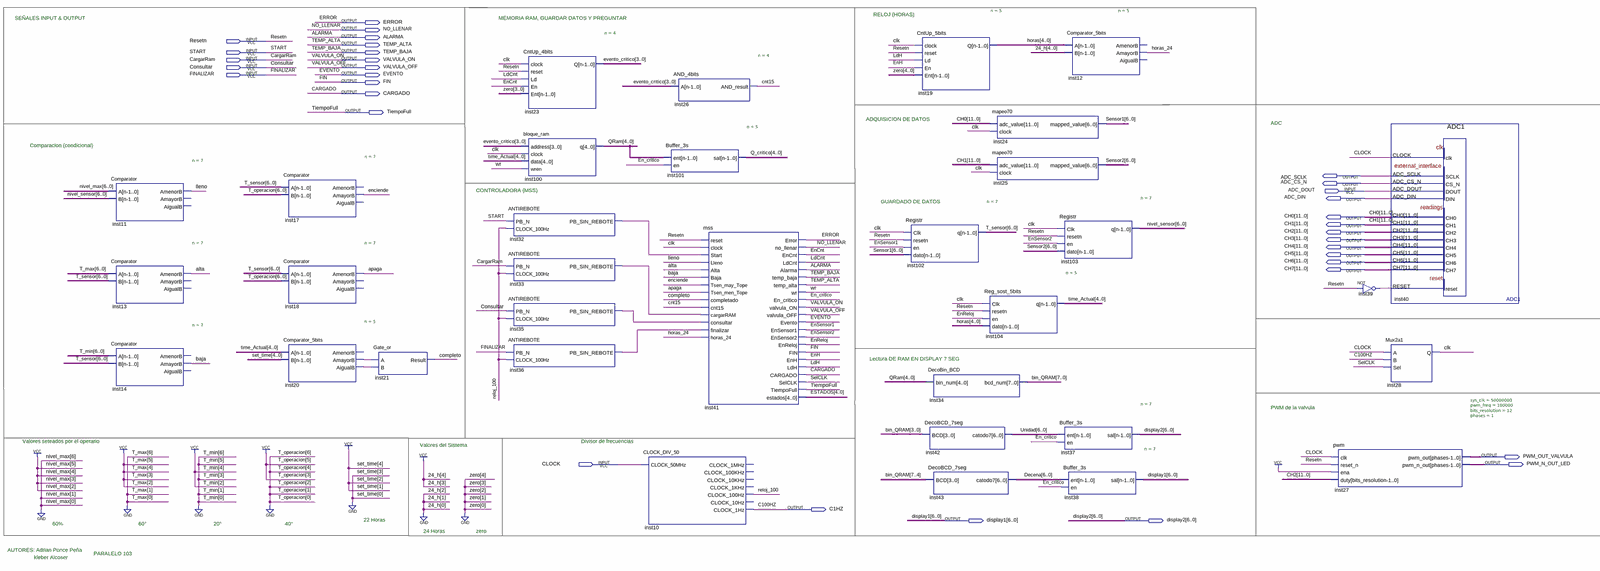
[diagram p0: schematic sheet, whole]
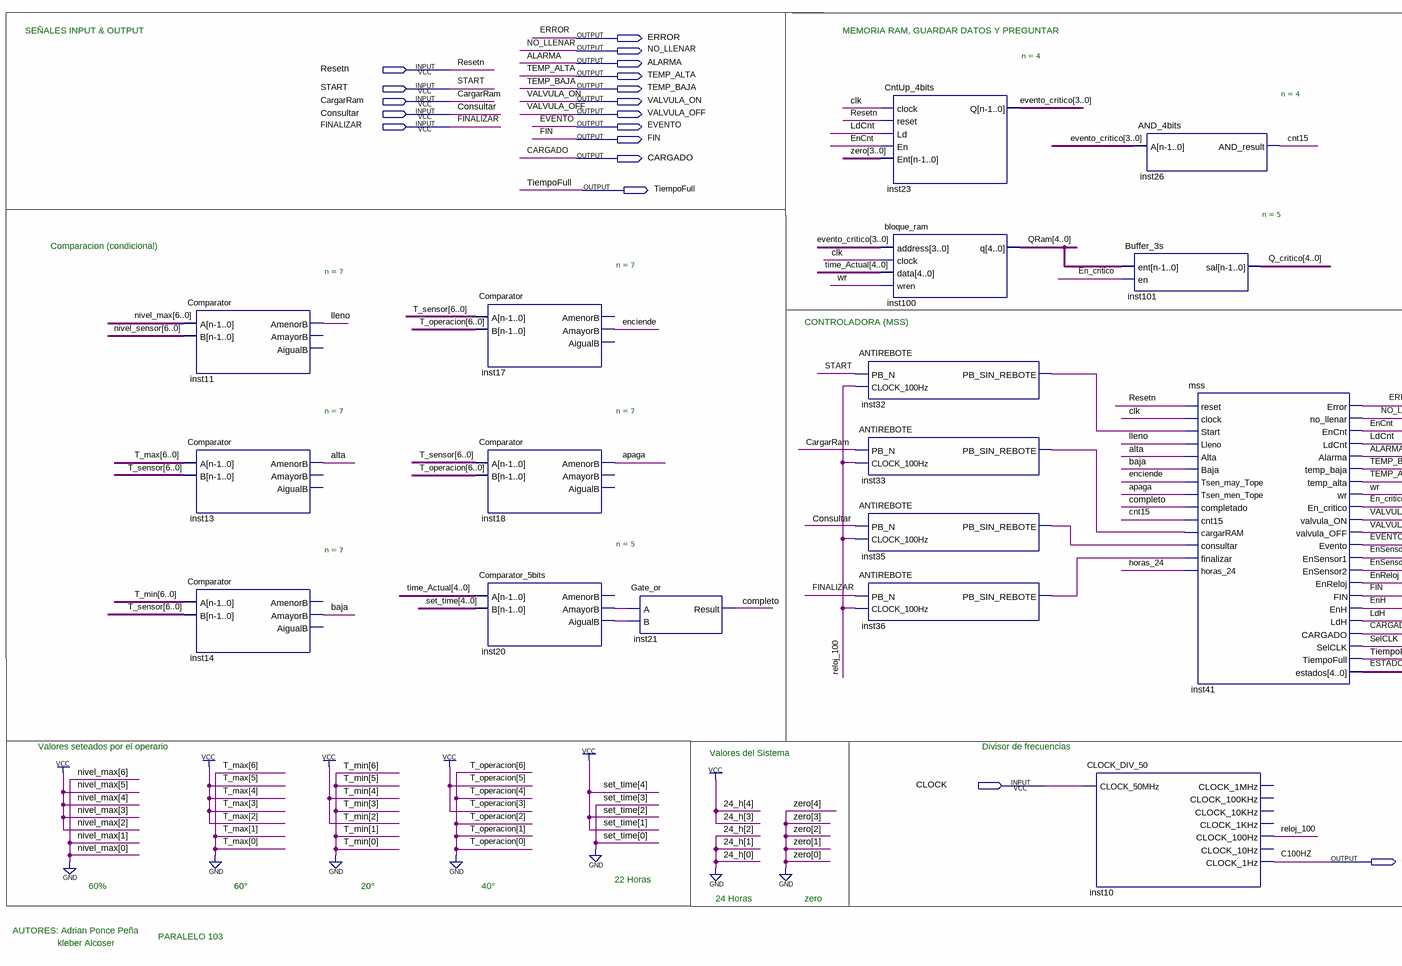
[diagram p1: schematic sheet, left part]
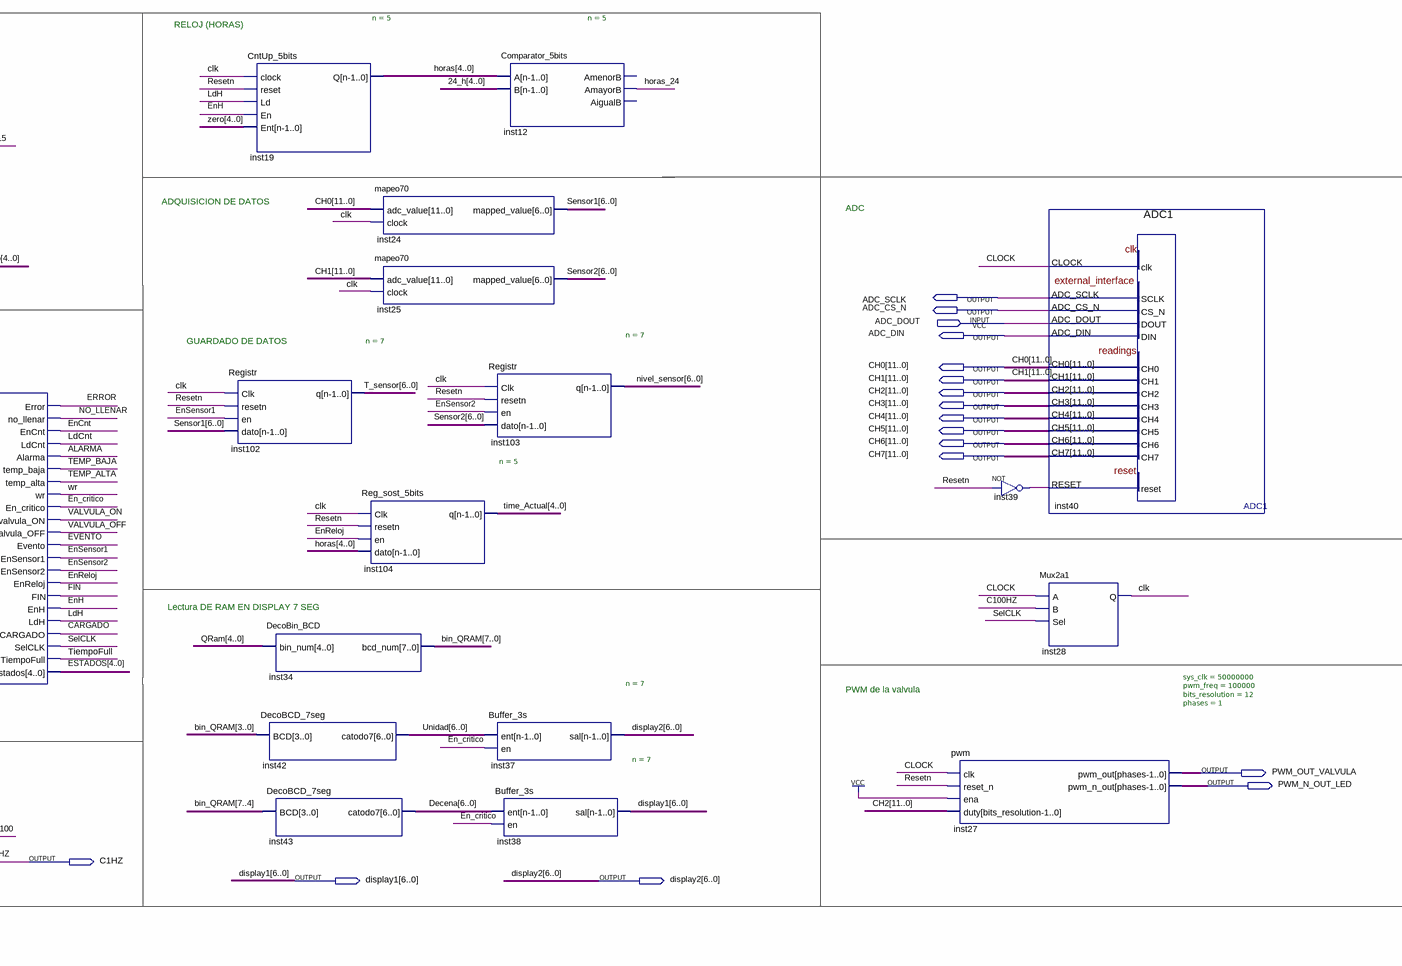
[diagram p2: schematic sheet, right part]
// Quartus schematic PROYECTO.bdf as structural Verilog: 33 symbols, 34 pins
module PROYECTO (
  input  Resetn,
  input  START,
  input  CargarRam,
  input  Consultar,
  input  FINALIZAR,
  input  ADC_DOUT,
  input  CLOCK,
  output ERROR,
  output NO_LLENAR,
  output ALARMA,
  output TEMP_ALTA,
  output TEMP_BAJA,
  output VALVULA_ON,
  output VALVULA_OFF,
  output EVENTO,
  output FIN,
  output CARGADO,
  output TiempoFull,
  output ADC_SCLK,
  output ADC_CS_N,
  output ADC_DIN,
  output [11:0] CH0,
  output [11:0] CH1,
  output [11:0] CH2,
  output [11:0] CH3,
  output [11:0] CH4,
  output [11:0] CH5,
  output [11:0] CH6,
  output [11:0] CH7,
  output PWM_OUT_VALVULA,
  output PWM_N_OUT_LED,
  output C1HZ,
  output [6:0] display1,
  output [6:0] display2
);

  wire alta, apaga, baja, clk, cnt15, completo, En_critico, enciende, EnCnt, EnH, EnReloj, EnSensor1,
       EnSensor2, horas_24, inst20_aigualb, inst20_amayorb, inst32_pb_sin_rebote, inst33_pb_sin_rebote,
       inst35_pb_sin_rebote, inst36_pb_sin_rebote, inst39_out, LdCnt, LdH, lleno, reloj_100, SelCLK, wr;
  wire [3:0] evento_critico;
  wire [4:0] ESTADOS, horas, Q_critico, QRam, time_Actual;
  wire [6:0] Decena, nivel_sensor, Sensor1, Sensor2, T_sensor, Unidad;
  wire [7:0] bin_QRAM;

  Comparator #(.n(7)) inst11 (.A(7'b0111100), .B(nivel_sensor), .AmenorB(lleno));  // open: AmayorB, AigualB
  Comparator #(.n(7)) inst13 (.A(7'b0111100), .B(T_sensor), .AmenorB(alta));  // open: AmayorB, AigualB
  Comparator #(.n(7)) inst14 (.A(7'b0010100), .B(T_sensor), .AmayorB(baja));  // open: AmenorB, AigualB
  Comparator #(.n(7)) inst17 (.A(T_sensor), .B(7'b0101000), .AmayorB(enciende));  // open: AmenorB, AigualB
  Comparator #(.n(7)) inst18 (.A(T_sensor), .B(7'b0101000), .AmenorB(apaga));  // open: AmayorB, AigualB
  Comparator_5bits #(.n(5)) inst20 (
    .A(time_Actual), .B(5'b10110), .AmayorB(inst20_amayorb), .AigualB(inst20_aigualb));  // open: AmenorB
  Gate_or inst21 (.A(inst20_amayorb), .B(inst20_aigualb), .Result(completo));
  ANTIREBOTE inst32 (.PB_N(START), .CLOCK_100Hz(reloj_100), .PB_SIN_REBOTE(inst32_pb_sin_rebote));
  ANTIREBOTE inst33 (.PB_N(CargarRam), .CLOCK_100Hz(reloj_100), .PB_SIN_REBOTE(inst33_pb_sin_rebote));
  ANTIREBOTE inst35 (.PB_N(Consultar), .CLOCK_100Hz(reloj_100), .PB_SIN_REBOTE(inst35_pb_sin_rebote));
  ANTIREBOTE inst36 (.PB_N(FINALIZAR), .CLOCK_100Hz(reloj_100), .PB_SIN_REBOTE(inst36_pb_sin_rebote));
  CntUp_4bits #(.n(4)) inst23 (.clock(clk), .reset(Resetn), .Ld(LdCnt), .En(EnCnt), .Ent(4'b0000), .Q(evento_critico));
  bloque_ram inst100 (.address(evento_critico), .clock(clk), .data(time_Actual), .wren(wr), .q(QRam));
  CLOCK_DIV_50 inst10 (
    .CLOCK_50MHz(CLOCK), .CLOCK_100Hz(reloj_100), .CLOCK_1Hz(C1HZ));  // open: CLOCK_1MHz, CLOCK_100KHz, CLOCK_10KHz, CLOCK_1KHz, CLOCK_10Hz
  AND_4bits #(.n(4)) inst26 (.A(evento_critico), .AND_result(cnt15));
  Buffer_3s #(.n(5)) inst101 (.ent(QRam), .en(En_critico), .sal(Q_critico));
  mss inst41 (
    .reset(Resetn), .clock(clk), .Start(inst32_pb_sin_rebote), .Lleno(lleno), .Alta(alta), .Baja(baja),
    .Tsen_may_Tope(enciende), .Tsen_men_Tope(apaga), .completado(completo), .cnt15(cnt15),
    .cargarRAM(inst33_pb_sin_rebote), .consultar(inst35_pb_sin_rebote), .finalizar(inst36_pb_sin_rebote),
    .horas_24(horas_24), .Error(ERROR), .no_llenar(NO_LLENAR), .EnCnt(EnCnt), .LdCnt(LdCnt), .Alarma(ALARMA),
    .temp_baja(TEMP_BAJA), .temp_alta(TEMP_ALTA), .wr(wr), .En_critico(En_critico), .valvula_ON(VALVULA_ON),
    .valvula_OFF(VALVULA_OFF), .Evento(EVENTO), .EnSensor1(EnSensor1), .EnSensor2(EnSensor2),
    .EnReloj(EnReloj), .FIN(FIN), .EnH(EnH), .LdH(LdH), .CARGADO(CARGADO), .SelCLK(SelCLK),
    .TiempoFull(TiempoFull), .estados(ESTADOS));
  CntUp_5bits #(.n(5)) inst19 (.clock(clk), .reset(Resetn), .Ld(LdH), .En(EnH), .Ent({5{1'b0}}), .Q(horas));
  Registr #(.n(7)) inst102 (.Clk(clk), .resetn(Resetn), .en(EnSensor1), .dato(Sensor1), .q(T_sensor));
  DecoBin_BCD inst34 (.bin_num(QRam), .bcd_num(bin_QRAM));
  DecoBCD_7seg inst42 (.BCD(bin_QRAM[3:0]), .catodo7(Unidad));
  DecoBCD_7seg inst43 (.BCD(bin_QRAM[7:4]), .catodo7(Decena));
  Reg_sost_5bits #(.n(5)) inst104 (.Clk(clk), .resetn(Resetn), .en(EnReloj), .dato(horas), .q(time_Actual));
  mapeo70 inst24 (.adc_value(CH0), .clock(clk), .mapped_value(Sensor1));
  mapeo70 inst25 (.adc_value(CH1), .clock(clk), .mapped_value(Sensor2));
  Comparator_5bits #(.n(5)) inst12 (.A(horas), .B(5'b11000), .AmayorB(horas_24));  // open: AmenorB, AigualB
  Registr #(.n(7)) inst103 (.Clk(clk), .resetn(Resetn), .en(EnSensor2), .dato(Sensor2), .q(nivel_sensor));
  Buffer_3s #(.n(7)) inst37 (.ent(Unidad), .en(En_critico), .sal(display2));
  Buffer_3s #(.n(7)) inst38 (.ent(Decena), .en(En_critico), .sal(display1));
  pwm #(.sys_clk(50000000), .pwm_freq(100000), .bits_resolution(12), .phases(1)) inst27 (
    .clk(CLOCK), .reset_n(Resetn), .ena(1'b1), .duty(CH2), .pwm_out(PWM_OUT_VALVULA),
    .pwm_n_out(PWM_N_OUT_LED));
  not inst39 (inst39_out, Resetn);
  ADC1 inst40 (
    .CLOCK(CLOCK), .ADC_DOUT(ADC_DOUT), .RESET(inst39_out), .ADC_SCLK(ADC_SCLK), .ADC_CS_N(ADC_CS_N),
    .ADC_DIN(ADC_DIN), .CH0(CH0), .CH1(CH1), .CH2(CH2), .CH3(CH3), .CH4(CH4), .CH5(CH5), .CH6(CH6), .CH7(CH7));
  Mux2a1 inst28 (.A(CLOCK), .B(C1HZ), .Sel(SelCLK), .Q(clk));

  // Other names for the same wires on the sheet: C100HZ = C1HZ

  // Notes on the sheet:
  //   RELOJ (HORAS)
  //   SEÑALES INPUT & OUTPUT
  //   MEMORIA RAM, GUARDAR DATOS Y PREGUNTAR
  //   ADQUISICION DE DATOS
  //   ADC
  //   Comparacion (condicional)
  //   CONTROLADORA (MSS)
  //   GUARDADO DE DATOS
  //   Lectura DE RAM EN DISPLAY 7 SEG
  //   PWM de la valvula
  //   Valores seteados por el operario
  //   Divisor de frecuencias
  //   Valores del Sistema
  //   22 Horas
  //   60%
  //   60°
  //   20°
  //   40°
  //   24 Horas
  //   zero
  //   AUTORES: Adrian Ponce Peña
  //   PARALELO 103
  //                     kleber Alcoser
endmodule
